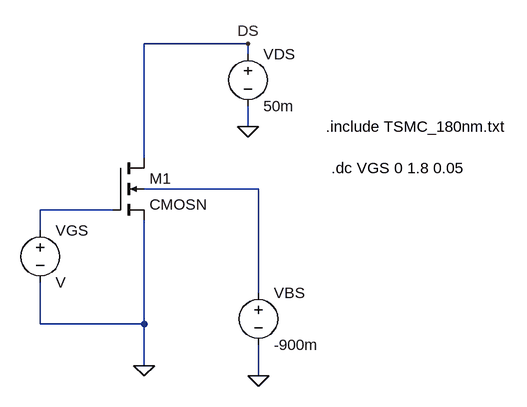
[diagram p0: schematic 3l(3).asc]
3l(3).asc, the LTspice schematic file:
Version 4
SHEET 1 996 680
WIRE 496 64 336 64
WIRE 496 80 496 64
WIRE 496 192 496 160
WIRE 336 240 336 64
WIRE 512 288 336 288
WIRE 288 320 176 320
WIRE 176 352 176 320
WIRE 512 448 512 288
WIRE 176 496 176 432
WIRE 336 496 336 336
WIRE 336 496 176 496
WIRE 336 560 336 496
WIRE 512 576 512 528
FLAG 336 560 0
FLAG 512 576 0
FLAG 496 192 0
FLAG 496 64 DS
SYMBOL nmos4 288 240 R0
SYMATTR InstName M1
SYMATTR Value CMOSN
SYMATTR Value2 l=0.18u w=1.8u ad=0.81p as=0.81p pd=4.5u ps=4.5u
SYMBOL voltage 176 336 R0
SYMATTR InstName VGS
SYMBOL voltage 496 64 R0
SYMATTR InstName VDS
SYMATTR Value 50m
SYMBOL voltage 512 432 R0
SYMATTR InstName VBS
SYMATTR Value -900m
TEXT 616 192 Left 2 !.include TSMC_180nm.txt
TEXT 624 256 Left 2 !.dc VGS 0 1.8 0.05

The netlist it stands for:
* 3l(3).asc
M1 DS N002 0 N001 CMOSN l=0.18u w=1.8u ad=0.81p as=0.81p pd=4.5u ps=4.5u
VGS N002 0 V
VDS DS 0 50m
VBS N001 0 -900m
.model NMOS NMOS
.model PMOS PMOS
.lib standard.mos
.include TSMC_180nm.txt
.dc VGS 0 1.8 0.05
.backanno
.end